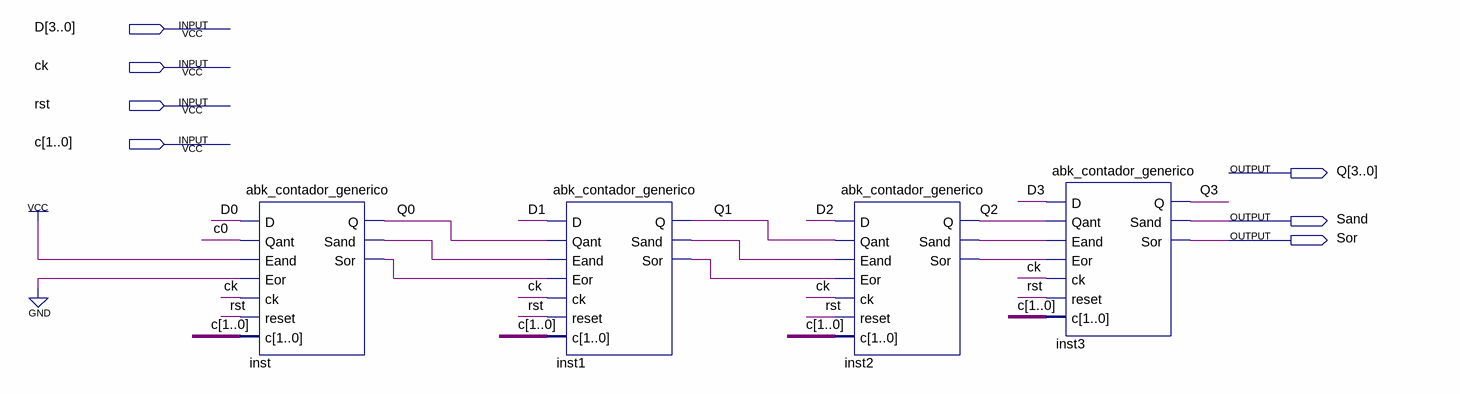
[diagram p0: schematic sheet]
// Quartus schematic abk_contador4bits.bdf as structural Verilog: 4 symbols, 7 pins
module abk_contador4bits (
  input  [3:0] D,
  input  ck,
  input  rst,
  input  [1:0] c,
  output [3:0] Q,
  output Sand,
  output Sor
);

  wire inst1_sand, inst1_sor, inst2_sand, inst2_sor, inst_sand, inst_sor;

  abk_contador_generico inst (
    .D(D[0]), .Qant(c[0]), .Eand(1'b1), .Eor(1'b0), .ck(ck), .reset(rst), .c(c), .Q(Q[0]), .Sand(inst_sand),
    .Sor(inst_sor));
  abk_contador_generico inst1 (
    .D(D[1]), .Qant(Q[0]), .Eand(inst_sand), .Eor(inst_sor), .ck(ck), .reset(rst), .c(c), .Q(Q[1]),
    .Sand(inst1_sand), .Sor(inst1_sor));
  abk_contador_generico inst2 (
    .D(D[2]), .Qant(Q[1]), .Eand(inst1_sand), .Eor(inst1_sor), .ck(ck), .reset(rst), .c(c), .Q(Q[2]),
    .Sand(inst2_sand), .Sor(inst2_sor));
  abk_contador_generico inst3 (
    .D(D[3]), .Qant(Q[2]), .Eand(inst2_sand), .Eor(inst2_sor), .ck(ck), .reset(rst), .c(c), .Q(Q[3]),
    .Sand(Sand), .Sor(Sor));
endmodule
